# Altium schematic sheet Sense_LDC1612.SchDoc
size A; SheetNumber: 2; SheetTotal: 7
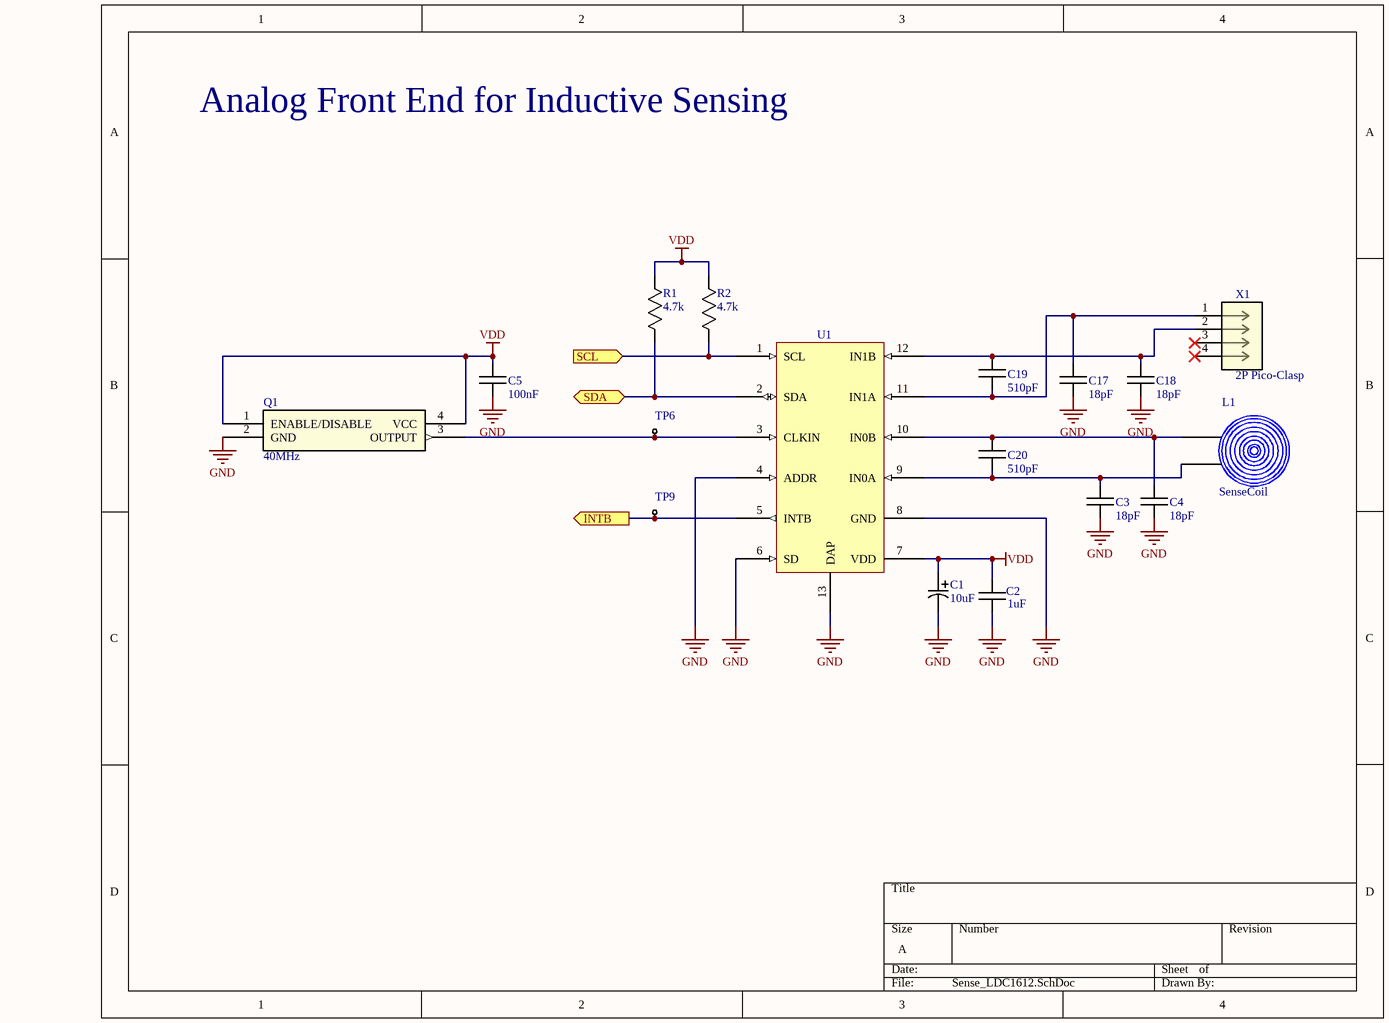
[diagram p0: Sense_LDC1612.SchDoc]

## Parts
C1  10uF  [CAP1206_TAJA]
C2  1uF  [CAP0805]
C3  18pF  [CAP0805]
C4  18pF  [CAP0805]
C5  100nF  [CAP0805]
C17  18pF  [CAP0805]
C18  18pF  [CAP0805]
C19  510pF  [CAP0805]
C20  510pF  [CAP0805]
L1  SenseCoil  [Coil_4L]
Q1  40MHz  [KC2520Z_KYO]
R1  4.7k  [RES0805]
R2  4.7k  [RES0805]
TP6  1mm Test Point  [TP_1MM]  (value not drawn)
TP9  1mm Test Point  [TP_1MM]  (value not drawn)
U1  Inductive Sensor 2Ch  [LDC1612]  (value not drawn)
X1  2P Pico-Clasp  [CON_2023960207]

## Ports
INTB (out, see Microcontroller_STM32F04[2B]), SCL (in, see HumTempSensor[3B], Microcontroller_STM32F04[1B]), SDA (bidir, see HumTempSensor[3B], Microcontroller_STM32F04[1B])

## Nets
GND: C1.2 C2.2 C3.2 C4.2 C5.2 C17.2 C18.2 Q1.2(GND) U1.4(ADDR) U1.6(SD) U1.8(GND) U1.13(DAP)
VDD: C1.1 C2.1 C5.1 Q1.1(ENABLE/DISABLE) Q1.4(VCC) R1.1 R2.1 U1.7(VDD)
INTB: TP9.1 U1.5(INTB) ; port INTB
SCL: R2.2 U1.1(SCL) ; port SCL
SDA: R1.2 U1.2(SDA) ; port SDA
NetC3_1: C3.1 C20.1 L1.1 U1.9(IN0A)
NetC4_1: C4.1 C20.2 L1.1 U1.10(IN0B)
NetC17_1: C17.1 C19.1 U1.11(IN1A) X1.1
NetC18_1: C18.1 C19.2 U1.12(IN1B) X1.2
NetQ1_3: Q1.3(OUTPUT) TP6.1 U1.3(CLKIN)

Not connected (* = marked no-connect by the designer): X1 3* 4*

## Notes on the sheet
- Analog Front End for Inductive Sensing

## Library data of the parts
C1 = TAJA106K016RNJ: Cap Tant Solid 10uF 16V A CASE 10%( 3.2 X 1.6 X 1.6mm) Inward L SMD 3216-18 3 Ohm 125C T/R; Mfr_Name: KYOCERA AVX; Type: DEV; Dielectric Material: Tantalum; Value: 10uF 16V 10% Tantalum; ESR (Equivalent Series Resistance): 3R; Leakage Current: 1.6uA; Dissipation Factor: 8%; Polarity: Polar; Frequency: 300MHz; Life (Hours): 2000Hour; Ripple Current: 158mA; Copyright: Copyright (C) 2023 Ultra Librarian. All rights reserved.; Manufacturer_Part_Number: TAJA106K016RNJ; RefDes: RefDes; Supplier: Digi-Key; Supplier Part Number: 478-1655-6-ND; Manufacturer: Kyocera AVX; Manufacturer Part Number: TAJA106K016RNJ; RoHS: Yes; Category: Tantalum Capacitors; Stock: 8878; Pricing: 1=0.35, 10=0.234, 50=0.1726, 100=0.1405, 500=0.1109, 1000=0.09365 (USD); Mounting Technology: Surface Mount,PCB; Case/Package: 1206; Pins: 2; Case Code (Metric): 3216; Case Code (Imperial): 1206; Min Operating Temperature: -55°C; Max Operating Temperature: 125°C; Tolerance: 10%; Packaging: Tape and Reel; Voltage Rating: 16V; Voltage Rating (DC): 16V; Features: General Purpose; Series: TAJ; Package Quantity: 1; Termination: SMD/SMT; Voltage: 16V; Construction: Flat; Voltage Rating (AC): 16V; Length: 3.2mm; Width: 1.6mm; Height: 1.6mm; Depth: 1.6mm; Height - Seated (Max): 0.071inch; Lead Pitch: 1.1mm; Size: 1.6mm; Radiation Hardening: No; Lead Free: Lead Free; RoHS Compliant: Yes; Reach SVHC Compliant: No; ComponentLink1URL: https://datasheet.ciiva.com/27051/1234933-27051768.pdf?src-supplier=Jameco; ComponentLink1Description: https://datasheet.ciiva.com/27051/1234933-27051768.pdf?src-supplier=Jameco; ComponentLink2URL: https://datasheet.ciiva.com/26341/559411-da-01-en-tacc-a-3-2-mm-x-1-6-mm-x-1-6-mm-10-uf-26341755.pdf?src-supplier=Conrad; ComponentLink2Description: https://datasheet.ciiva.com/26341/559411-da-01-en-tacc-a-3-2-mm-x-1-6-mm-x-1-6-mm-10-uf-26341755.pdf?src-supplier=Conrad; ComponentLink3URL: https://datasheet.ciiva.com/18710/taj-eng-18710622.pdf?src-supplier=Distrelec; ComponentLink3Description: https://datasheet.ciiva.com/18710/taj-eng-18710622.pdf?src-supplier=Distrelec; ComponentLink4URL: https://datasheet.ciiva.com/7730/1703059-7730712.pdf?src-supplier=Element14; ComponentLink4Description: https://datasheet.ciiva.com/7730/1703059-7730712.pdf?src-supplier=Element14; ComponentLink5URL: https://datasheet.ciiva.com/7730/1703059-7730713.pdf?src-supplier=Element14; ComponentLink5Description: https://datasheet.ciiva.com/7730/1703059-7730713.pdf?src-supplier=Element14; ComponentLink6URL: https://datasheet.ciiva.com/7730/taj-7730975.pdf?src-supplier=Element14; ComponentLink6Description: https://datasheet.ciiva.com/7730/taj-7730975.pdf?src-supplier=Element14; ComponentLink7URL: https://datasheet.ciiva.com/7730/1680476-7730714.pdf?src-supplier=Element14; ComponentLink7Description: https://datasheet.ciiva.com/7730/1680476-7730714.pdf?src-supplier=Element14; ComponentLink8URL: https://datasheet.ciiva.com/263/taj-263392.pdf?src-supplier=Digi-Key; ComponentLink8Description: https://datasheet.ciiva.com/263/taj-263392.pdf?src-supplier=Digi-Key; ComponentLink9URL: https://datasheet.ciiva.com/263/taj-263391.pdf?src-supplier=Digi-Key; ComponentLink9Description: https://datasheet.ciiva.com/263/taj-263391.pdf?src-supplier=Digi-Key; ComponentLink10URL: https://datasheet.ciiva.com/263/taj-263393.pdf?src-supplier=Digi-Key; ComponentLink10Description: https://datasheet.ciiva.com/263/taj-263393.pdf?src-supplier=Digi-Key; ComponentLink11URL: https://datasheet.ciiva.com/12882/taj-27497-12882509.pdf?src-supplier=Mouser; ComponentLink11Description: https://datasheet.ciiva.com/12882/taj-27497-12882509.pdf?src-supplier=Mouser; ComponentLink12URL: https://datasheet.ciiva.com/3004/taj-3004388.pdf?src-supplier=Avnet; ComponentLink12Description: https://datasheet.ciiva.com/3004/taj-3004388.pdf?src-supplier=Avnet; ComponentLink13URL: https://datasheet.ciiva.com/16379/taj-16379015.pdf?src-supplier=Future+Electronics; ComponentLink13Description: https://datasheet.ciiva.com/16379/taj-16379015.pdf?src-supplier=Future+Electronics; ComponentLink14URL: https://datasheet.ciiva.com/3004/taj-3004387.pdf?src-supplier=Avnet; ComponentLink14Description: https://datasheet.ciiva.com/3004/taj-3004387.pdf?src-supplier=Avnet; LCSC Part#: C7171
C2 = CL21B105KBFNNNE: Multilayer Ceramic Capacitor, 1 uF, 50 V, ± 10%, X7R, 0805 [2012 Metric]; Manufacturer: Samsung; Value: 1uF 50V; Voltage Rating: 50V; Dielectric Material: Tantalum; Temperature Coefficient: 0ppm/°C; Supplier: Digi-Key; Supplier Part Number: 1276-1029-1-ND; Manufacturer Part Number: CL21B105KBFNNNE; RoHS: Yes; Category: Ceramic Capacitors; Stock: 1577316; Pricing: 1=0.11, 10=0.075, 50=0.045, 100=0.0354, 500=0.02616, 1000=0.02165 (USD); Mounting Technology: Surface Mount; Case/Package: 0805; Case Code (Metric): 2012; Case Code (Imperial): 0805; Material: Ceramic; Min Operating Temperature: -55°C; Max Operating Temperature: 125°C; Tolerance: 10%; Packaging: Tape and Reel; Package Quantity: 1; Dielectric: X7R; Voltage: 50V; Series: CL; Construction: Flat; Voltage Rating (DC): 50V; Length: 2mm; Width: 0.049inch; Height: 1.25mm; Thickness: 0.053inch; Depth: 1.25mm; Radiation Hardening: No; RoHS Compliant: Yes; ComponentLink1URL: https://datasheet.ciiva.com/25800/cl21b105kbfnnne-25800291.pdf?src-supplier=Digi-Key; ComponentLink1Description: https://datasheet.ciiva.com/25800/cl21b105kbfnnne-25800291.pdf?src-supplier=Digi-Key; Pins: 2; Termination: SMD/SMT; Lead Free: Lead Free; ComponentLink2URL: https://datasheet.ciiva.com/16511/vjw1bcbascomseries-16511277.pdf?src-supplier=Future+Electronics; ComponentLink2Description: https://datasheet.ciiva.com/16511/vjw1bcbascomseries-16511277.pdf?src-supplier=Future+Electronics; ComponentLink3URL: https://datasheet.ciiva.com/176/vjw1bcbascomseries-176732.pdf?src-supplier=Digi-Key; ComponentLink3Description: https://datasheet.ciiva.com/176/vjw1bcbascomseries-176732.pdf?src-supplier=Digi-Key; LCSC Part#: C28323
C3 C4 C17 C18 = VJ0805A180JXACW1BC: 0805 18 pF 50 V ±5 % Tolerance C0G/NP0 SMT Multilayer Ceramic Chip Capacitor; Manufacturer: Vishay; Dielectric Material: Tantalum; Tolerance: 5%; Voltage Rating: 50V; Dielectric: C0G; Temperature Coefficient: 0ppm/°C; Supplier: Digi-Key; Supplier Part Number: 720-1628-1-ND; Manufacturer Part Number: VJ0805A180JXACW1BC; RoHS: Yes; Category: Ceramic Capacitors; Stock: 4074; Pricing: 1=0.2, 10=0.132, 50=0.079, 100=0.0622, 500=0.0459, 1000=0.038 (USD); Mounting Technology: Surface Mount; Case/Package: 0805; Pins: 2; Case Code (Imperial): 0805; Case Code (Metric): 2012; Min Operating Temperature: -55°C; Max Operating Temperature: 125°C; Value: 18pF 50V; Voltage Rating (DC): 50V; Packaging: Tape and Reel; Package Quantity: 4000; Termination: SMD/SMT; Series: VJ; Construction: Flat; Length: 2mm; Width: 1.25mm; Height: 1.45mm; Thickness: 0.03inch; Depth: 1.25mm; Radiation Hardening: No; Lead Free: Lead Free; RoHS Compliant: Yes; ComponentLink1URL: https://datasheet.ciiva.com/16511/vjw1bcbascomseries-16511277.pdf?src-supplier=Future+Electronics; ComponentLink1Description: https://datasheet.ciiva.com/16511/vjw1bcbascomseries-16511277.pdf?src-supplier=Future+Electronics; ComponentLink2URL: https://datasheet.ciiva.com/176/vjw1bcbascomseries-176732.pdf?src-supplier=Digi-Key; ComponentLink2Description: https://datasheet.ciiva.com/176/vjw1bcbascomseries-176732.pdf?src-supplier=Digi-Key; LCSC Part#: C2174299
C5 = CC0805KRX7R9BB104: Multilayer Ceramic Capacitor, 0.1 uF, 50 V, ± 10%, X7R, 0805 [2012 Metric]; Manufacturer: Yageo; Value: 100nF 50V; Voltage: 50V; Insulation Resistance: 100GR; Supplier: Digi-Key; Supplier Part Number: 311-1140-1-ND; Manufacturer Part Number: CC0805KRX7R9BB104; RoHS: Yes; Category: Ceramic Capacitors; Stock: 6426664; Pricing: 1=0.1, 10=0.07, 50=0.0418, 100=0.0329, 500=0.02428, 1000=0.0201 (USD); Mounting Technology: Surface Mount; Case/Package: 0805; Pins: 2; Case Code (Metric): 2012; Case Code (Imperial): 0805; Material: Ceramic; Min Operating Temperature: -55°C; Max Operating Temperature: 125°C; Tolerance: 10%; Dielectric: X7R; Packaging: Tape and Reel; Voltage Rating: 50V; Package Quantity: 4000; Termination: SMD/SMT; Series: CC; Length: 2mm; Height: 0.85mm; Depth: 1.25mm; Radiation Hardening: No; RoHS Compliant: Yes; Reach SVHC Compliant: No; Lead Free: Lead Free; Halogen Free: Halogen Free; ComponentLink1URL: https://datasheet.ciiva.com/11786/0900766b80d84f1d-11786009.pdf?src-supplier=Rs; ComponentLink1Description: https://datasheet.ciiva.com/11786/0900766b80d84f1d-11786009.pdf?src-supplier=Rs; ComponentLink2URL: https://datasheet.ciiva.com/46393/1734573-46393307.pdf?src-supplier=Element14; ComponentLink2Description: https://datasheet.ciiva.com/46393/1734573-46393307.pdf?src-supplier=Element14; ComponentLink3URL: https://datasheet.ciiva.com/155/mlccorderingcode-155930.pdf?src-supplier=Digi-Key; ComponentLink3Description: https://datasheet.ciiva.com/155/mlccorderingcode-155930.pdf?src-supplier=Digi-Key; ComponentLink4URL: https://datasheet.ciiva.com/155/mlccorderingcode-155929.pdf?src-supplier=Digi-Key; ComponentLink4Description: https://datasheet.ciiva.com/155/mlccorderingcode-155929.pdf?src-supplier=Digi-Key; ComponentLink5URL: https://datasheet.ciiva.com/155/mlccorderingcode-155931.pdf?src-supplier=Digi-Key; ComponentLink5Description: https://datasheet.ciiva.com/155/mlccorderingcode-155931.pdf?src-supplier=Digi-Key; ComponentLink6URL: https://datasheet.ciiva.com/11464/upy-gphc-x7r-6-3v-to-50v-8-11464757.pdf?src-supplier=Avnet; ComponentLink6Description: https://datasheet.ciiva.com/11464/upy-gphc-x7r-6-3v-to-50v-8-11464757.pdf?src-supplier=Avnet; ComponentLink7URL: https://datasheet.ciiva.com/28450/1489800-28450805.pdf?src-supplier=Element14; ComponentLink7Description: https://datasheet.ciiva.com/28450/1489800-28450805.pdf?src-supplier=Element14; ComponentLink8URL: https://datasheet.ciiva.com/29242/445210-da-01-en-kerko-chip-0805-x7r-0-1uf-10proz-50vg-29242074.pdf?src-supplier=Conrad; ComponentLink8Description: https://datasheet.ciiva.com/29242/445210-da-01-en-kerko-chip-0805-x7r-0-1uf-10proz-50vg-29242074.pdf?src-supplier=Conrad; LCSC Part#: C49678
C19 C20 = CC0805JRNPO9BN511: 0805 510 pF 50 V ±5 % Tolerance NP0 SMT Multilayer Ceramic Capacitor; Manufacturer: Yageo; Tolerance: 5%; Voltage Rating (DC): 50V; Supplier: Digi-Key; Supplier Part Number: 311-4240-1-ND; Manufacturer Part Number: CC0805JRNPO9BN511; RoHS: Yes; Category: Ceramic Capacitors; Stock: 4065; Pricing: 1=0.18, 10=0.119, 50=0.071, 100=0.0559, 500=0.04124, 1000=0.03415 (USD); Mounting Technology: Surface Mount; Case/Package: 0805; Case Code (Imperial): 0805; Case Code (Metric): 2012; Weight: 0.000194oz; Min Operating Temperature: -55°C; Max Operating Temperature: 125°C; Value: 510pF 50V; Packaging: Tape and Reel; Voltage Rating: 50V; Dielectric: NP0; Termination: SMD/SMT; Series: CC; Length: 0.079inch; Width: 0.049inch; Thickness: 0.028inch; Lead Free: Lead Free; ComponentLink1URL: http://www.mouser.com/ds/2/447/Yageo_UPY-GP_NP0_16V-to-50V_9-358835.pdf?src-supplier=Mouser; ComponentLink1Description: http://www.mouser.com/ds/2/447/Yageo_UPY-GP_NP0_16V-to-50V_9-358835.pdf?src-supplier=Mouser; ComponentLink2URL: https://www.yageo.com/upload/media/product/productsearch/datasheet/mlcc/UPY-GP_NP0_16V-to-50V_18.pdf?src-supplier=Digi-Key; ComponentLink2Description: https://www.yageo.com/upload/media/product/productsearch/datasheet/mlcc/UPY-GP_NP0_16V-to-50V_18.pdf?src-supplier=Digi-Key; ComponentLink3URL: http://www.yageo.com/documents/recent/UPY-GP_NP0_16V-to-50V_16.pdf?src-supplier=Digi-Key; ComponentLink3Description: http://www.yageo.com/documents/recent/UPY-GP_NP0_16V-to-50V_16.pdf?src-supplier=Digi-Key; ComponentLink4URL: http://www.yageo.com/exep/pages/download/literatures/ProductSelectionGuide%202014_Final_2.pdf?src-supplier=Digi-Key; ComponentLink4Description: http://www.yageo.com/exep/pages/download/literatures/ProductSelectionGuide%202014_Final_2.pdf?src-supplier=Digi-Key; ComponentLink5URL: http://www.yageo.com/documents/recent/UPY-GP_NP0_16V-to-50V_9.pdf?src-supplier=Future+Electronics; ComponentLink5Description: http://www.yageo.com/documents/recent/UPY-GP_NP0_16V-to-50V_9.pdf?src-supplier=Future+Electronics; ComponentLink6URL: https://datasheet.octopart.com/CC0805JRNPO9BN511-Yageo-datasheet-151948684.pdf?src-supplier=Newark; ComponentLink6Description: https://datasheet.octopart.com/CC0805JRNPO9BN511-Yageo-datasheet-151948684.pdf?src-supplier=Newark; LCSC Part#: C309486
Q1 = KC2520Z40.0000C15XXK: Xtal Osc Xo 40.0000MHZ Cmos SMD; Manufacturer: Kyocera AVX; Supplier: Digi-Key; Supplier Part Number: 478-KC2520Z40.0000C15XXKCT-ND; Manufacturer Part Number: KC2520Z40.0000C15XXK; RoHS: No; Category: Oscillators; Stock: 9175; Pricing: 1=1.16, 10=1.107, 50=1.0816, 100=0.927, 500=0.90124, 1000=0.75962 (USD); LCSC Part#: C1857241; Value: KC2520Z40.0000C15XXK
R1 R2 = ERJ-6GEYJ472V: Res Thick Film 0805 4.7K Ohm 5% 1/8W ±200ppm/°C Molded SMD Punched Carrier T/R; Manufacturer: Panasonic; Value: 4.7kR; Power Rating: 125mW; Voltage Rating: 150V; Supplier: Digi-Key; Supplier Part Number: P4.7KACT-ND; Manufacturer Part Number: ERJ-6GEYJ472V; RoHS: Yes; Category: Chip SMD Resistors; Stock: 148739; Pricing: 1=0.1, 10=0.038, 50=0.0244, 100=0.0206, 500=0.01434, 1000=0.01248 (USD); Mounting Technology: Surface Mount; Case/Package: 0805; Case Code (Metric): 2012; Case Code (Imperial): 0805; Contact Plating: Tin; Min Operating Temperature: -55°C; Max Operating Temperature: 155°C; Tolerance: 5%; Packaging: Tape and Reel; Package Quantity: 1; Termination: SMD/SMT; Max Power Dissipation: 125mW; Series: ERJ; Resistance Tolerance: 5%; Resistor Type: Thick Film; Number of Terminations: 2; Temperature Coefficient: 200ppm/°C; Construction: Rectangular; Technology: THICK FILM; Voltage Rating (DC): 150V; Length: 2mm; Width: 1.25mm; Height: 0.6mm; Depth: 1.25mm; Radiation Hardening: No; Reach SVHC Compliant: No; RoHS Compliant: Yes; Military Standard: Not; Lead Free: Lead Free; LCSC Part#: C230645
TP6 TP9 = TestPoint_1mm
U1 = LDC1612: 2-Ch, 28-bit, high-resolution Inductance to digital converter 12-WSON -40 to 125; Manufacturer: Texas Instruments; Manufacturer Part Number: LDC1612DNTR; Interface: I2C; Number of Inputs: 2; Value: LDC1612DNTR; Package: WSON-12; Supplier: Digi-Key; Supplier Part Number: 296-LDC1612DNCT-ND; RoHS: Yes; Category: Integrated Circuits (ICs); Stock: 21433; Pricing: 1=3.68, 10=3.305, 25=3.1248, 100=2.7081, 250=2.5692, 500=2.30532, 1000=1.94425 (USD); Mounting Technology: Surface Mount; Pins: 12; Min Operating Temperature: -40°C; Max Operating Temperature: 125°C; Series: *; Packaging: Tape and Reel; Number of Channels: 2; Lead Free: Lead Free; RoHS Compliant: Yes; ComponentLink2URL: http://www.ti.com/general/docs/suppproductinfo.tsp?distId=10&amp;gotoUrl=http%3A%2F%2Fwww.ti.com%2Flit%2Fgpn%2Fldc1612&src-supplier=Digi-Key; ComponentLink2Description: http://www.ti.com/general/docs/suppproductinfo.tsp?distId=10&amp;gotoUrl=http%3A%2F%2Fwww.ti.com%2Flit%2Fgpn%2Fldc1612&src-supplier=Digi-Key; ComponentLink3URL: http://www.ti.com/general/docs/lit/getliterature.tsp?genericPartNumber=LDC1614&&fileType=pdf&src-supplier=Avnet; ComponentLink3Description: http://www.ti.com/general/docs/lit/getliterature.tsp?genericPartNumber=LDC1614&&fileType=pdf&src-supplier=Avnet; ComponentLink4URL: http://www.ti.com/lit/gpn/ldc1612?src-supplier=Mouser; ComponentLink4Description: http://www.ti.com/lit/gpn/ldc1612?src-supplier=Mouser; LCSC Part#: C1847959
X1 = 202396-0207: Conn Shrouded Header (4 Sides) HDR 2 POS 1mm Solder RA Side Entry SMD Pico-Clasp™ T/R; Manufacturer: Molex; Number of Positions: 2; Value: 2023960207; Supplier: Digi-Key; Supplier Part Number: WM26783CT-ND; Manufacturer Part Number: 202396-0207; RoHS: No; Category: Headers and Wire Housings; Stock: 6710; Pricing: 1=0.97, 10=0.804, 100=0.6698 (USD); Mounting Technology: Surface Mount; Contact Material: Bronze; Contact Shape: Square; Insulation Material: Nylon; Insulation Color: Natural; Contact Finish - Mating: GOLD; Min Operating Temperature: -40°C; Max Operating Temperature: 105°C; Connector Type: Header; Fastening Type: Latch; Packaging: Tape and Reel; Number of Rows: 1; Termination: Solder; Series: Pico-Clasp 202396; Contact Type: Male Pin; Flammability Rating: UL94 V-0; ComponentLink1URL: http://datasheet.octopart.com/2023960207-Molex-datasheet-147952241.pdf?src-supplier=Digi-Key; ComponentLink1Description: http://datasheet.octopart.com/2023960207-Molex-datasheet-147952241.pdf?src-supplier=Digi-Key; ComponentLink2URL: https://www.molex.com/pdm_docs/sd/2023960207_sd.pdf?src-supplier=Digi-Key; ComponentLink2Description: https://www.molex.com/pdm_docs/sd/2023960207_sd.pdf?src-supplier=Digi-Key; ComponentLink3URL: http://datasheet.octopart.com/2023960207-Molex-datasheet-147952241.pdf?src-supplier=Newark; ComponentLink3Description: http://datasheet.octopart.com/2023960207-Molex-datasheet-147952241.pdf?src-supplier=Newark; ComponentLink4URL: http://datasheet.octopart.com/2023960207-Molex-datasheet-147952241.pdf?src-supplier=Farnell; ComponentLink4Description: http://datasheet.octopart.com/2023960207-Molex-datasheet-147952241.pdf?src-supplier=Farnell; ComponentLink5URL: http://datasheet.octopart.com/2023960207-Molex-datasheet-147952241.pdf?src-supplier=Avnet; ComponentLink5Description: http://datasheet.octopart.com/2023960207-Molex-datasheet-147952241.pdf?src-supplier=Avnet; ComponentLink6URL: http://datasheet.octopart.com/2023960207-Molex-datasheet-147952241.pdf?src-supplier=Arrow+Electronics; ComponentLink6Description: http://datasheet.octopart.com/2023960207-Molex-datasheet-147952241.pdf?src-supplier=Arrow+Electronics; ComponentLink7URL: http://datasheet.octopart.com/2023960207-Molex-datasheet-147952241.pdf?src-supplier=TTI; ComponentLink7Description: http://datasheet.octopart.com/2023960207-Molex-datasheet-147952241.pdf?src-supplier=TTI; ComponentLink8URL: http://datasheet.octopart.com/2023960207-Molex-datasheet-147952241.pdf?src-supplier=Electro+Sonic; ComponentLink8Description: http://datasheet.octopart.com/2023960207-Molex-datasheet-147952241.pdf?src-supplier=Electro+Sonic; ComponentLink9URL: https://datasheet.octopart.com/202396-0207-Molex-datasheet-134623761.pdf?src-supplier=TME; ComponentLink9Description: https://datasheet.octopart.com/202396-0207-Molex-datasheet-134623761.pdf?src-supplier=TME; LCSC Part#: C585325